# Altium schematic sheet MCU.SchDoc
size A4; SheetNumber: 1; SheetTotal: 1
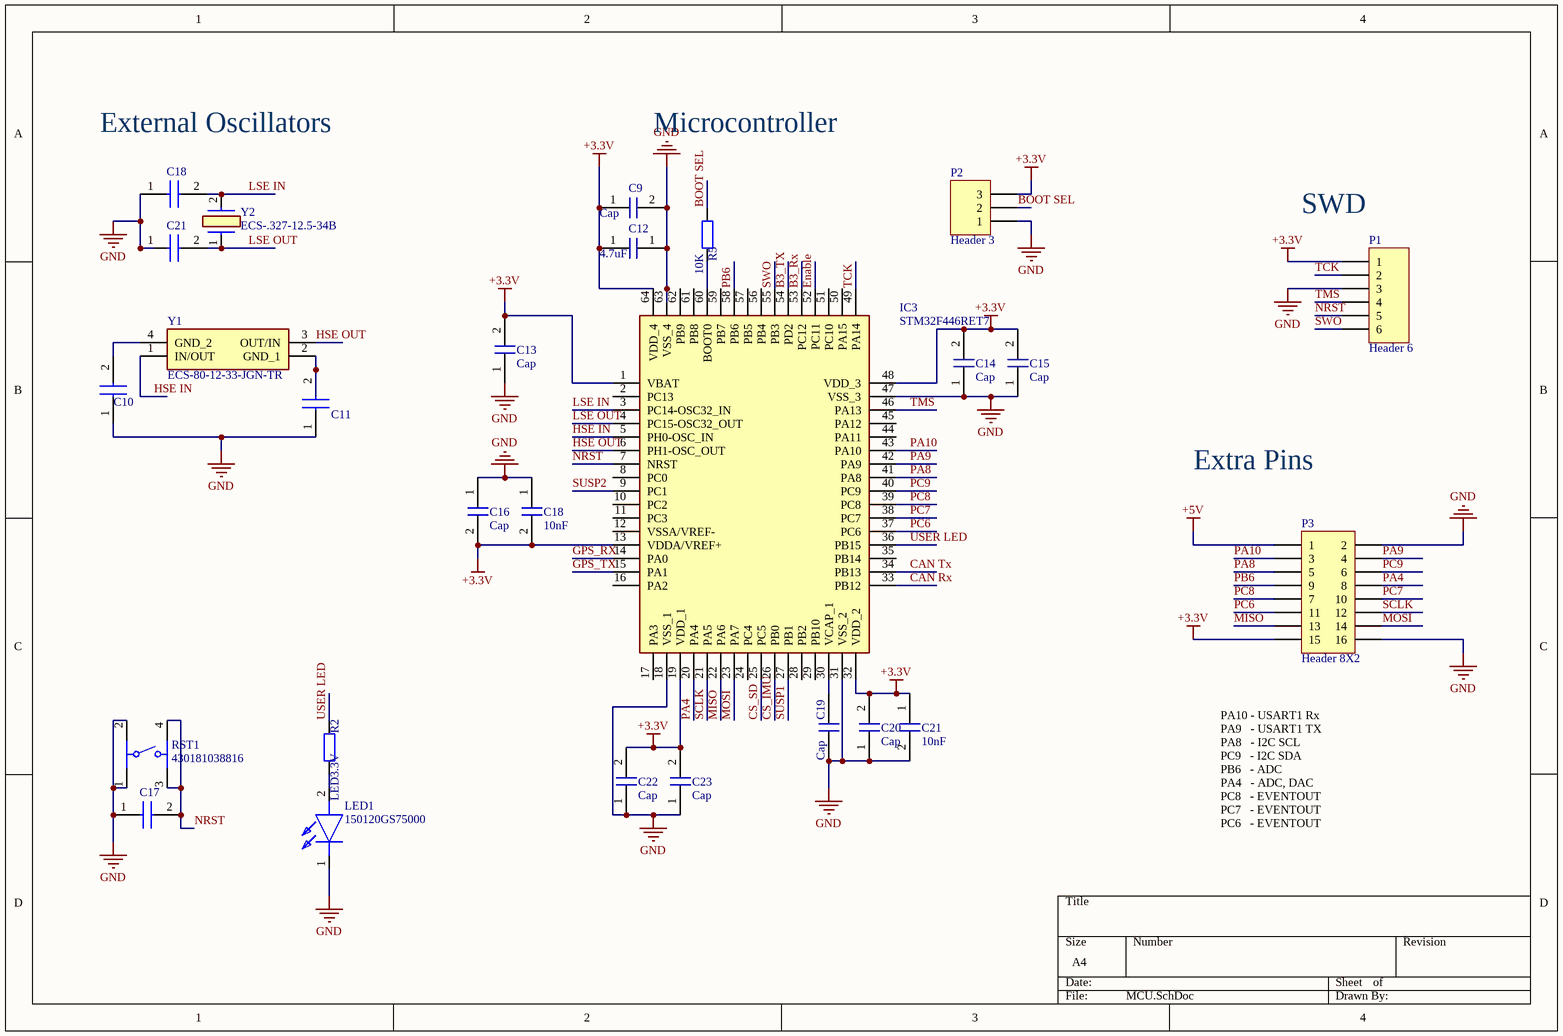
[diagram p0: MCU.SchDoc]

## Parts
(Parts that share a designator on the sheet are numbered #1, #2 ... from top to bottom, then left to right.)
C9  Cap  [C 0805]
C10  885012207126  [CAPC1608X90N]  (value not drawn)
C11  885012207126  [CAPC1608X90N]  (value not drawn)
C12  4.7uF  [C 1206]
C13  Cap  [C 1206]
C14  Cap  [C 0805]
C15  Cap  [C 1206]
C16  Cap  [C 0805]
C17  06035C104JAT2A  [C 1206]  (value not drawn)
C18#1  885012207126  [CAPC1608X90N]  (value not drawn)
C18#2  10nF  [C 0805P]
C19  Cap  [C 0805]
C20  Cap  [C 1206]
C21#1  885012207126  [CAPC1608X90N]  (value not drawn)
C21#2  10nF  [C 0805P]
C22  Cap  [C 1206]
C23  Cap  [C 1206]
IC3  STM32F446RET7  [Pins 1.2mm]
LED1  150120GS75000  [LEDC3214X78N]
P1  Header 6  [HDR1X6]
P2  Header 3  [HDR1X3]
P3  Header 8X2  [HDR2X8]
R2  LED3.3V  [R 0805]
R5  10K  [R 0805]
RST1  430181038816  [430181038816]
Y1  ECS-80-12-33-JGN-TR  [ECS801233JGNTR]
Y2  ECS-.327-12.5-34B  [ECX-31B]

## Nets
+3.3V: C9.1 C12.1 C13.2 C14.2 C15.2 C16.2 C18#2.2 C20.2 C21#2.1 C22.2 C23.2 IC3.1(VBAT) IC3.13(VDDA/VREF+) IC3.19(VDD_1) IC3.32(VDD_2) IC3.48(VDD_3) IC3.64(VDD_4) P1.1 P2.3 P3.15
+5V: P3.1
GND: C9.2 C10.1 C11.1 C12.1 C13.1 C14.1 C15.1 C16.1 C17.1 C18#1.1 C18#2.1 C19.1 C20.1 C21#1.1 C21#2.2 C22.1 C23.1 IC3.18(VSS_1) IC3.31(VSS_2) IC3.47(VSS_3) IC3.63(VSS_4) LED1.1(K) P1.3 P2.1 P3.2 P3.16 RST1.1 RST1.2
B3_Rx: IC3.53(PC12)
B3_TX: IC3.54(PD2)
BOOT SEL: P2.2 R5.2
CAN Rx: IC3.33(PB12)
CAN Tx: IC3.34(PB13)
CS_IMU: IC3.26(PB0)
CS_SD: IC3.25(PC5)
Enable: IC3.52(PC11)
GPS_RX: IC3.14(PA0)
GPS_TX: IC3.15(PA1)
HSE IN: IC3.5(PH0-OSC_IN) Y1.1(IN/OUT)
HSE OUT: IC3.6(PH1-OSC_OUT) Y1.3(OUT/IN)
LSE IN: C18#1.2 IC3.3(PC14-OSC32_IN) Y2.2
LSE OUT: C21#1.2 IC3.4(PC15-OSC32_OUT) Y2.1
MISO: IC3.22(PA6) P3.13
MOSI: IC3.23(PA7) P3.14
NRST: C17.2 IC3.7(NRST) P1.5 RST1.3 RST1.4
PA4: IC3.20(PA4) P3.8
PA8: IC3.41(PA8) P3.5
PA9: IC3.42(PA9) P3.4
PA10: IC3.43(PA10) P3.3
PB6: IC3.58(PB6) P3.9
PC6: IC3.37(PC6) P3.11
PC7: IC3.38(PC7) P3.10
PC8: IC3.39(PC8) P3.7
PC9: IC3.40(PC9) P3.6
SCLK: IC3.21(PA5) P3.12
SUSP1: IC3.27(PB1)
SUSP2: IC3.9(PC1)
SWO: IC3.55(PB3) P1.6
TCK: IC3.49(PA14) P1.2
TMS: IC3.46(PA13) P1.4
USER LED: IC3.36(PB15) R2.2
NetC10_2: C10.2 Y1.4(GND_2)
NetC11_2: C11.2 Y1.2(GND_1)
NetC19_1: C19.1 IC3.30(VCAP_1)
NetIC3_60: IC3.60(BOOT0) R5.1
NetLED1_2: LED1.2(A) R2.1

Not connected (* = marked no-connect by the designer): IC3 2(PC13) 8(PC0) 10(PC2) 11(PC3) 12(VSSA/VREF-) 16(PA2) 17(PA3) 24(PC4) 28(PB2) 29(PB10) 35(PB14) 44(PA11) 45(PA12) 50(PA15) 51(PC10) 56(PB4) 57(PB5) 59(PB7) 61(PB8) 62(PB9)

## Notes on the sheet
- External Oscillators
- Microcontroller
- (near P1) SWD
- Extra Pins
- PA10 - USART1 Rx
  PA9   - USART1 TX
  PA8   - I2C SCL
  PC9   - I2C SDA
  PB6   - ADC
  PA4   - ADC, DAC
  PC8   - EVENTOUT
  PC7   - EVENTOUT
  PC6   - EVENTOUT

## Library data of the parts
C9 C12-C16 C18#2 C19 C20 C21#2 C22 C23 = Condensador
C10 C11 C18#1 C21#1 = 885012207126: Capacitor; Manufacturer_Name: Wurth Elektronik; Datasheet Link: https://katalog.we-online.com/pbs/datasheet/885012207126.pdf; Height: 1.35mm; Manufacturer_Part_Number: 885012207126; Mouser Part Number: 710-885012207126; Mouser Price/Stock: https://www.mouser.co.uk/ProductDetail/Wurth-Elektronik/885012207126?qs=MLItCLRbWsx1mdA6iQ1T9Q%3D%3D
C17 = 06035C104JAT2A: Capacitor; Manufacturer_Name: AVX; Datasheet Link: http://www.mouser.com/catalog/supplier/library/pdf/AVXSurfaceMountCeramic.pdf; Height: 0.9mm; Manufacturer_Part_Number: 06035C104JAT2A; Mouser Part Number: 581-06035C104JAT2A; Mouser Price/Stock: https://www.mouser.co.uk/ProductDetail/AVX/06035C104JAT2A/?qs=EbDiPP9peV%252BVb%2FIEcsjONQ%3D%3D; Arrow Part Number: 06035C104JAT2A; Arrow Price/Stock: https://www.arrow.com/en/products/06035c104jat2a/avx
IC3 = STM32F446RET7: Integrated Circuit; Manufacturer_Name: STMicroelectronics; Datasheet Link: https://componentsearchengine.com/Datasheets/5/STM32F446RET7.pdf; Height: 1.6mm; Manufacturer_Part_Number: STM32F446RET7; Mouser Part Number: 511-STM32F446RET7; Mouser Price/Stock: https://www.mouser.co.uk/ProductDetail/STMicroelectronics/STM32F446RET7?qs=qzCNEk%252BRr%252BZ3vIhuSM4Ejg%3D%3D; Arrow Part Number: STM32F446RET7; Arrow Price/Stock: https://www.arrow.com/en/products/stm32f446ret7/stmicroelectronics?region=nac
LED1 = 150120GS75000: LED; Manufacturer_Name: Wurth Elektronik; Height: 0.78mm; Manufacturer_Part_Number: 150120GS75000; Mouser Part Number: 710-150120GS75000; Mouser Price/Stock: https://www.mouser.co.uk/ProductDetail/Wurth-Elektronik/150120GS75000?qs=LlUlMxKIyB3I3AMxrmBw4A%3D%3D
P1 = Header 6: Header, 6-Pin; LatestRevisionDate: 17-Jul-2002; LatestRevisionNote: Re-released for DXP Platform.; Publisher: Altium Limited
P2 = Header 3: Header, 3-Pin; LatestRevisionDate: 17-Jul-2002; LatestRevisionNote: Re-released for DXP Platform.; Publisher: Altium Limited
P3 = Header 8X2: Header, 8-Pin, Dual row; LatestRevisionDate: 17-Jul-2002; LatestRevisionNote: Re-released for DXP Platform.; Publisher: Altium Limited
R2 R5 = 560050320011: WRIS-KSKE SMT Thick Film Resistor, size 0805, 1Ohm, 0.33W; Manufacturer: Wurth Elektronik; Rated Current: 0.57A; Temperature Coefficient of Resistance: +/-100ppm/degC; Technical Reference: KE08051R00F103KAATP0000; Resistance Tolerance: +/-1%; ComponentLink1Description: Manufacturer; ComponentLink1URL: http://www.we-online.de; ComponentLink2Description: Datasheet; ComponentLink2URL: https://www.we-online.com/catalog/datasheet/560050320011.pdf; Published Date: May 2020; Rated Power: 0.33W; Resistance: 1Ohm; Height: 0.6mm; Operating Temperature: -55 to +155degC; Mounting Technology: SMT; Packaging: Tape and Reel; Size: 0805; Length: 2mm; Manufacturer Part Number: 560050320011; Width: 1.25mm
RST1 = 430181038816: WS-TASV SMT Tact Switch 4.5x4.5mm, height 3.8mm, 160gf; Rated Voltage: 12VDC; Rated Current: 50mA; Washable: No; ComponentLink1Description: Manufacturer; ComponentLink1URL: http://www.we-online.de; ComponentLink2Description: Datasheet; ComponentLink2URL: https://katalog.we-online.com/em/datasheet/430181038816.pdf; Operating Temperature: -40 to +85degC; Part Number: 430181038816; Published Date: September 2019; Contact Material: Stainless Steel; Height: 3.8mm; Mounting Technology: SMT; Contact Plating: Silver; Operation Force: 160gf; Packaging: Tape and Reel; Terminal Material: Copper Alloy; Publisher: Wurth Elektronik; Terminal Plating: Silver
Y1 = ECS-80-12-33-JGN-TR: Crystal or Oscillator; Manufacturer_Name: ECS; Datasheet Link: https://ecsxtal.com/store/pdf/ecx-32.pdf; Height: 0.8mm; Manufacturer_Part_Number: ECS-80-12-33-JGN-TR; Mouser Part Number: 520-80-12-33-JGN-TR; Mouser Price/Stock: https://www.mouser.co.uk/ProductDetail/ECS/ECS-80-12-33-JGN-TR?qs=d0WKAl%252BL4KaVcQK0q%252BTt4Q%3D%3D; Arrow Part Number: ECS-80-12-33-JGN-TR; Arrow Price/Stock: https://www.arrow.com/en/products/ecs-80-12-33-jgn-tr/ecs-international?region=nac
Y2 = ECS-.327-12.5-34B: Crystal or Oscillator; Manufacturer_Name: ECS; Datasheet Link: https://componentsearchengine.com/Datasheets/1/ECS-.327-12.5-34B.pdf; Manufacturer_Part_Number: ECS-.327-12.5-34B; Mouser Part Number: 520-ECS-327-12.5-34B; Mouser Price/Stock: https://www.mouser.co.uk/ProductDetail/ECS/ECS-.327-12.5-34B?qs=muFWWzTLGEJ4ncukpyY8Bw%3D%3D